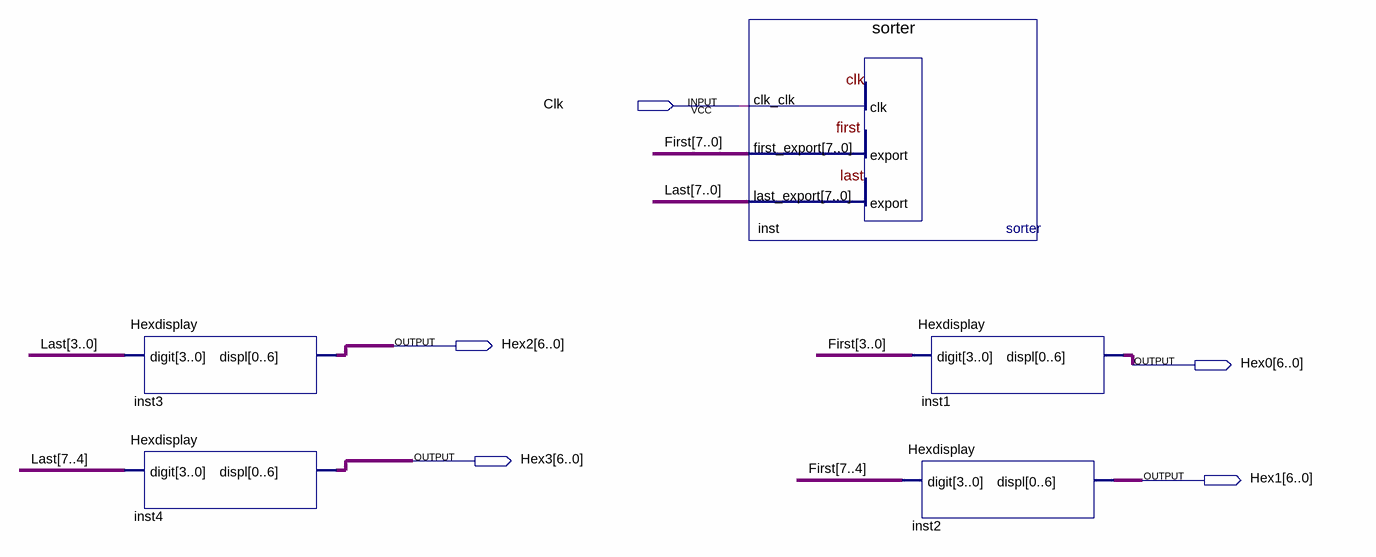
[diagram p0: schematic sheet]
// Quartus schematic SortNios.bdf as structural Verilog: 5 symbols, 5 pins
module SortNios (
  input  Clk,
  output [6:0] Hex2,
  output [6:0] Hex0,
  output [6:0] Hex3,
  output [6:0] Hex1
);

  wire [7:0] First, Last;

  Hexdisplay inst3 (.digit(Last[3:0]), .displ(Hex2));
  Hexdisplay inst4 (.digit(Last[7:4]), .displ(Hex3));
  sorter inst (.clk_clk(Clk), .first_export(First), .last_export(Last));
  Hexdisplay inst1 (.digit(First[3:0]), .displ(Hex0));
  Hexdisplay inst2 (.digit(First[7:4]), .displ(Hex1));
endmodule
